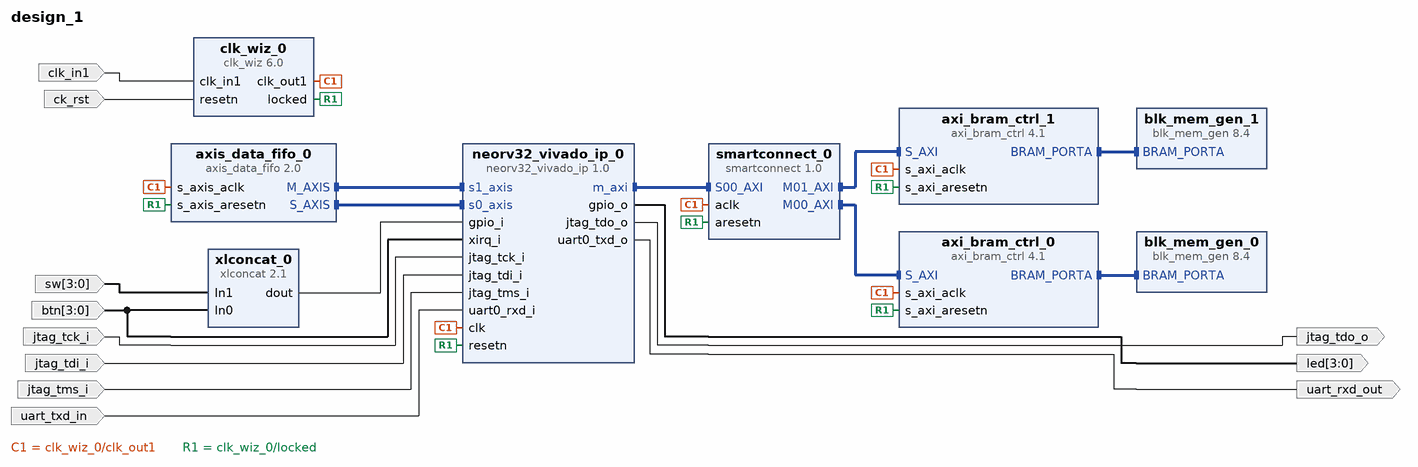
[diagram p0: block diagram of the top level]
# Vivado block design design_1, xc7a100tcsg324-1, Vivado 2024.1.2
create_bd_design design_1

create_bd_port -dir I jtag_tms_i
create_bd_port -dir I jtag_tck_i
create_bd_port -dir I jtag_tdi_i
create_bd_port -dir O jtag_tdo_o
create_bd_port -dir O -from 3 -to 0 led
create_bd_port -dir I uart_txd_in
create_bd_port -dir O uart_rxd_out
create_bd_port -dir I -type clk clk_in1
create_bd_port -dir I -from 3 -to 0 btn
create_bd_port -dir I -from 3 -to 0 sw
create_bd_port -dir I -type rst ck_rst

create_bd_cell -type ip -vlnv NEORV32:user:neorv32_vivado_ip:1.0 neorv32_vivado_ip_0
set_property -dict [list \
  CONFIG.IO_GPIO_EN true \
  CONFIG.IO_GPIO_IN_NUM 8 \
  CONFIG.IO_GPIO_OUT_NUM 4 \
  CONFIG.IO_SLINK_EN true \
  CONFIG.IO_SLINK_RX_FIFO 4 \
  CONFIG.IO_SLINK_TX_FIFO 4 \
  CONFIG.IO_UART0_EN true \
  CONFIG.OCD_EN true \
  CONFIG.XIRQ_EN true \
  CONFIG.XIRQ_NUM_CH 4 \
] [get_bd_cells neorv32_vivado_ip_0]
create_bd_cell -type ip -vlnv xilinx.com:ip:smartconnect:1.0 smartconnect_0
set_property -dict {CONFIG.NUM_MI 2 CONFIG.NUM_SI 1} [get_bd_cells smartconnect_0]
create_bd_cell -type ip -vlnv xilinx.com:ip:axi_bram_ctrl:4.1 axi_bram_ctrl_0
set_property -dict {CONFIG.SINGLE_PORT_BRAM 1} [get_bd_cells axi_bram_ctrl_0]
create_bd_cell -type ip -vlnv xilinx.com:ip:axi_bram_ctrl:4.1 axi_bram_ctrl_1
set_property -dict {CONFIG.SINGLE_PORT_BRAM 1} [get_bd_cells axi_bram_ctrl_1]
create_bd_cell -type ip -vlnv xilinx.com:ip:blk_mem_gen:8.4 blk_mem_gen_0
create_bd_cell -type ip -vlnv xilinx.com:ip:blk_mem_gen:8.4 blk_mem_gen_1
create_bd_cell -type ip -vlnv xilinx.com:ip:axis_data_fifo:2.0 axis_data_fifo_0
create_bd_cell -type ip -vlnv xilinx.com:ip:clk_wiz:6.0 clk_wiz_0
set_property -dict {CONFIG.RESET_PORT resetn CONFIG.RESET_TYPE ACTIVE_LOW} [get_bd_cells clk_wiz_0]
create_bd_cell -type ip -vlnv xilinx.com:ip:xlconcat:2.1 xlconcat_0
set_property -dict {CONFIG.IN0_WIDTH 4 CONFIG.IN1_WIDTH 4} [get_bd_cells xlconcat_0]

# ---- connections ----

connect_bd_intf_net [get_bd_intf_pins axi_bram_ctrl_0/BRAM_PORTA] [get_bd_intf_pins blk_mem_gen_0/BRAM_PORTA]
connect_bd_intf_net [get_bd_intf_pins axi_bram_ctrl_1/BRAM_PORTA] [get_bd_intf_pins blk_mem_gen_1/BRAM_PORTA]
connect_bd_intf_net [get_bd_intf_pins axis_data_fifo_0/M_AXIS] [get_bd_intf_pins neorv32_vivado_ip_0/s1_axis]
connect_bd_intf_net [get_bd_intf_pins neorv32_vivado_ip_0/m_axi] [get_bd_intf_pins smartconnect_0/S00_AXI]
connect_bd_intf_net [get_bd_intf_pins axis_data_fifo_0/S_AXIS] [get_bd_intf_pins neorv32_vivado_ip_0/s0_axis]
connect_bd_intf_net [get_bd_intf_pins axi_bram_ctrl_0/S_AXI] [get_bd_intf_pins smartconnect_0/M00_AXI]
connect_bd_intf_net [get_bd_intf_pins axi_bram_ctrl_1/S_AXI] [get_bd_intf_pins smartconnect_0/M01_AXI]
connect_bd_net -net In0_0_1 [get_bd_ports btn] [get_bd_pins xlconcat_0/In0] [get_bd_pins neorv32_vivado_ip_0/xirq_i]
connect_bd_net -net In1_0_1 [get_bd_ports sw] [get_bd_pins xlconcat_0/In1]
connect_bd_net -net clk_in1_0_1 [get_bd_ports clk_in1] [get_bd_pins clk_wiz_0/clk_in1]
connect_bd_net [get_bd_pins clk_wiz_0/clk_out1] \
  [get_bd_pins axis_data_fifo_0/s_axis_aclk] [get_bd_pins neorv32_vivado_ip_0/clk] [get_bd_pins smartconnect_0/aclk] \
  [get_bd_pins axi_bram_ctrl_1/s_axi_aclk] [get_bd_pins axi_bram_ctrl_0/s_axi_aclk]
connect_bd_net [get_bd_pins clk_wiz_0/locked] \
  [get_bd_pins axis_data_fifo_0/s_axis_aresetn] [get_bd_pins axi_bram_ctrl_1/s_axi_aresetn] \
  [get_bd_pins smartconnect_0/aresetn] [get_bd_pins axi_bram_ctrl_0/s_axi_aresetn] [get_bd_pins neorv32_vivado_ip_0/resetn]
connect_bd_net -net jtag_tck_i_0_1 [get_bd_ports jtag_tck_i] [get_bd_pins neorv32_vivado_ip_0/jtag_tck_i]
connect_bd_net -net jtag_tdi_i_0_1 [get_bd_ports jtag_tdi_i] [get_bd_pins neorv32_vivado_ip_0/jtag_tdi_i]
connect_bd_net -net jtag_tms_i_0_1 [get_bd_ports jtag_tms_i] [get_bd_pins neorv32_vivado_ip_0/jtag_tms_i]
connect_bd_net [get_bd_pins neorv32_vivado_ip_0/gpio_o] [get_bd_ports led]
connect_bd_net [get_bd_pins neorv32_vivado_ip_0/jtag_tdo_o] [get_bd_ports jtag_tdo_o]
connect_bd_net [get_bd_pins neorv32_vivado_ip_0/uart0_txd_o] [get_bd_ports uart_rxd_out]
connect_bd_net -net resetn_0_1 [get_bd_ports ck_rst] [get_bd_pins clk_wiz_0/resetn]
connect_bd_net -net uart0_rxd_i_0_1 [get_bd_ports uart_txd_in] [get_bd_pins neorv32_vivado_ip_0/uart0_rxd_i]
connect_bd_net [get_bd_pins xlconcat_0/dout] [get_bd_pins neorv32_vivado_ip_0/gpio_i]

# ---- address map ----
assign_bd_address -offset 0xC0000000 -range 8K -target_address_space [get_bd_addr_spaces neorv32_vivado_ip_0/m_axi] [get_bd_addr_segs axi_bram_ctrl_0/S_AXI/Mem0]
assign_bd_address -offset 0xC2000000 -range 8K -target_address_space [get_bd_addr_spaces neorv32_vivado_ip_0/m_axi] [get_bd_addr_segs axi_bram_ctrl_1/S_AXI/Mem0]

validate_bd_design
save_bd_design
